# Altium schematic sheet main_MCU-edited.SchDoc
size 1016 x 635 mm; SheetNumber: 1; SheetTotal: 2
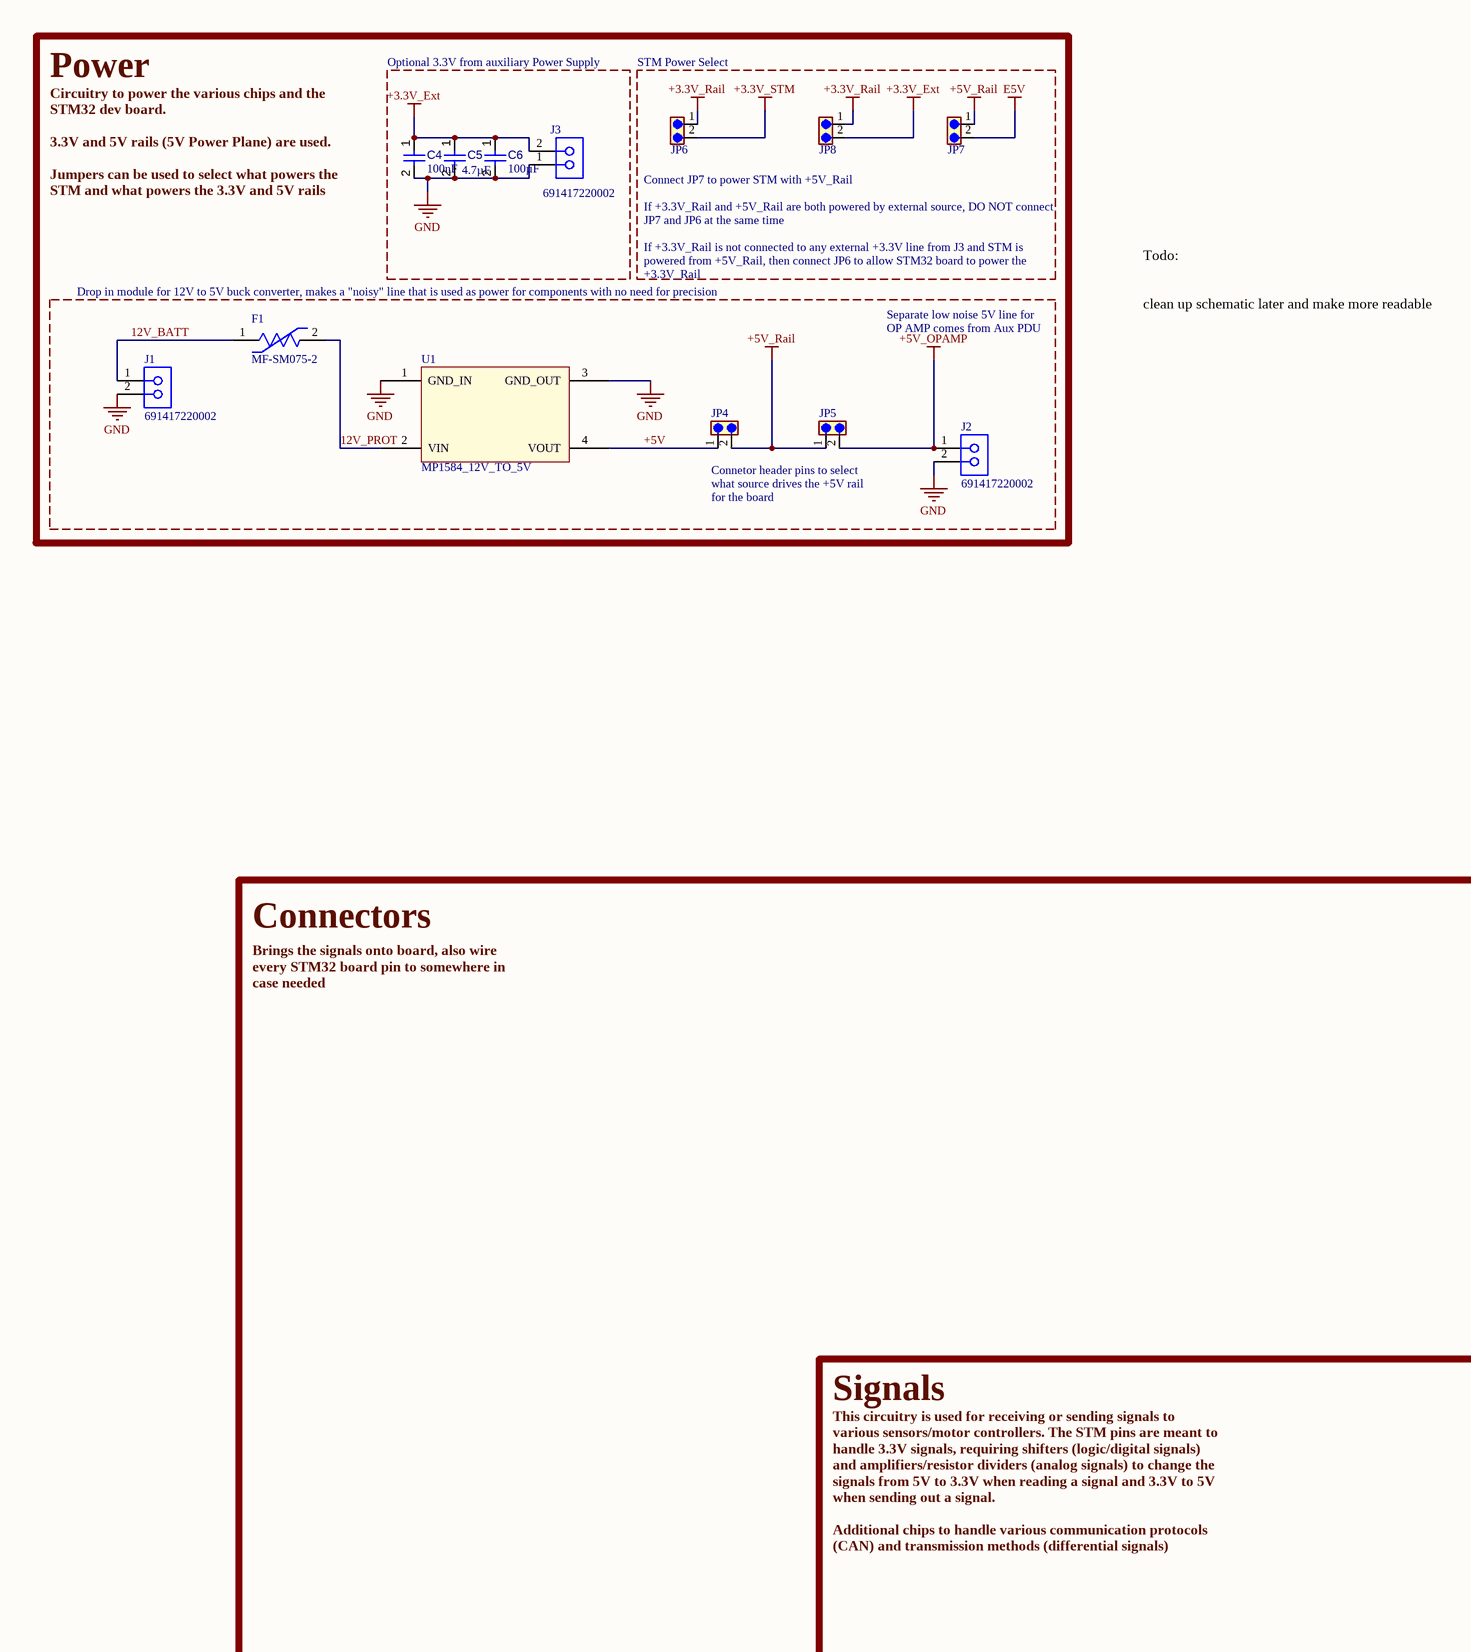
[diagram p0: main_MCU-edited.SchDoc, top left]
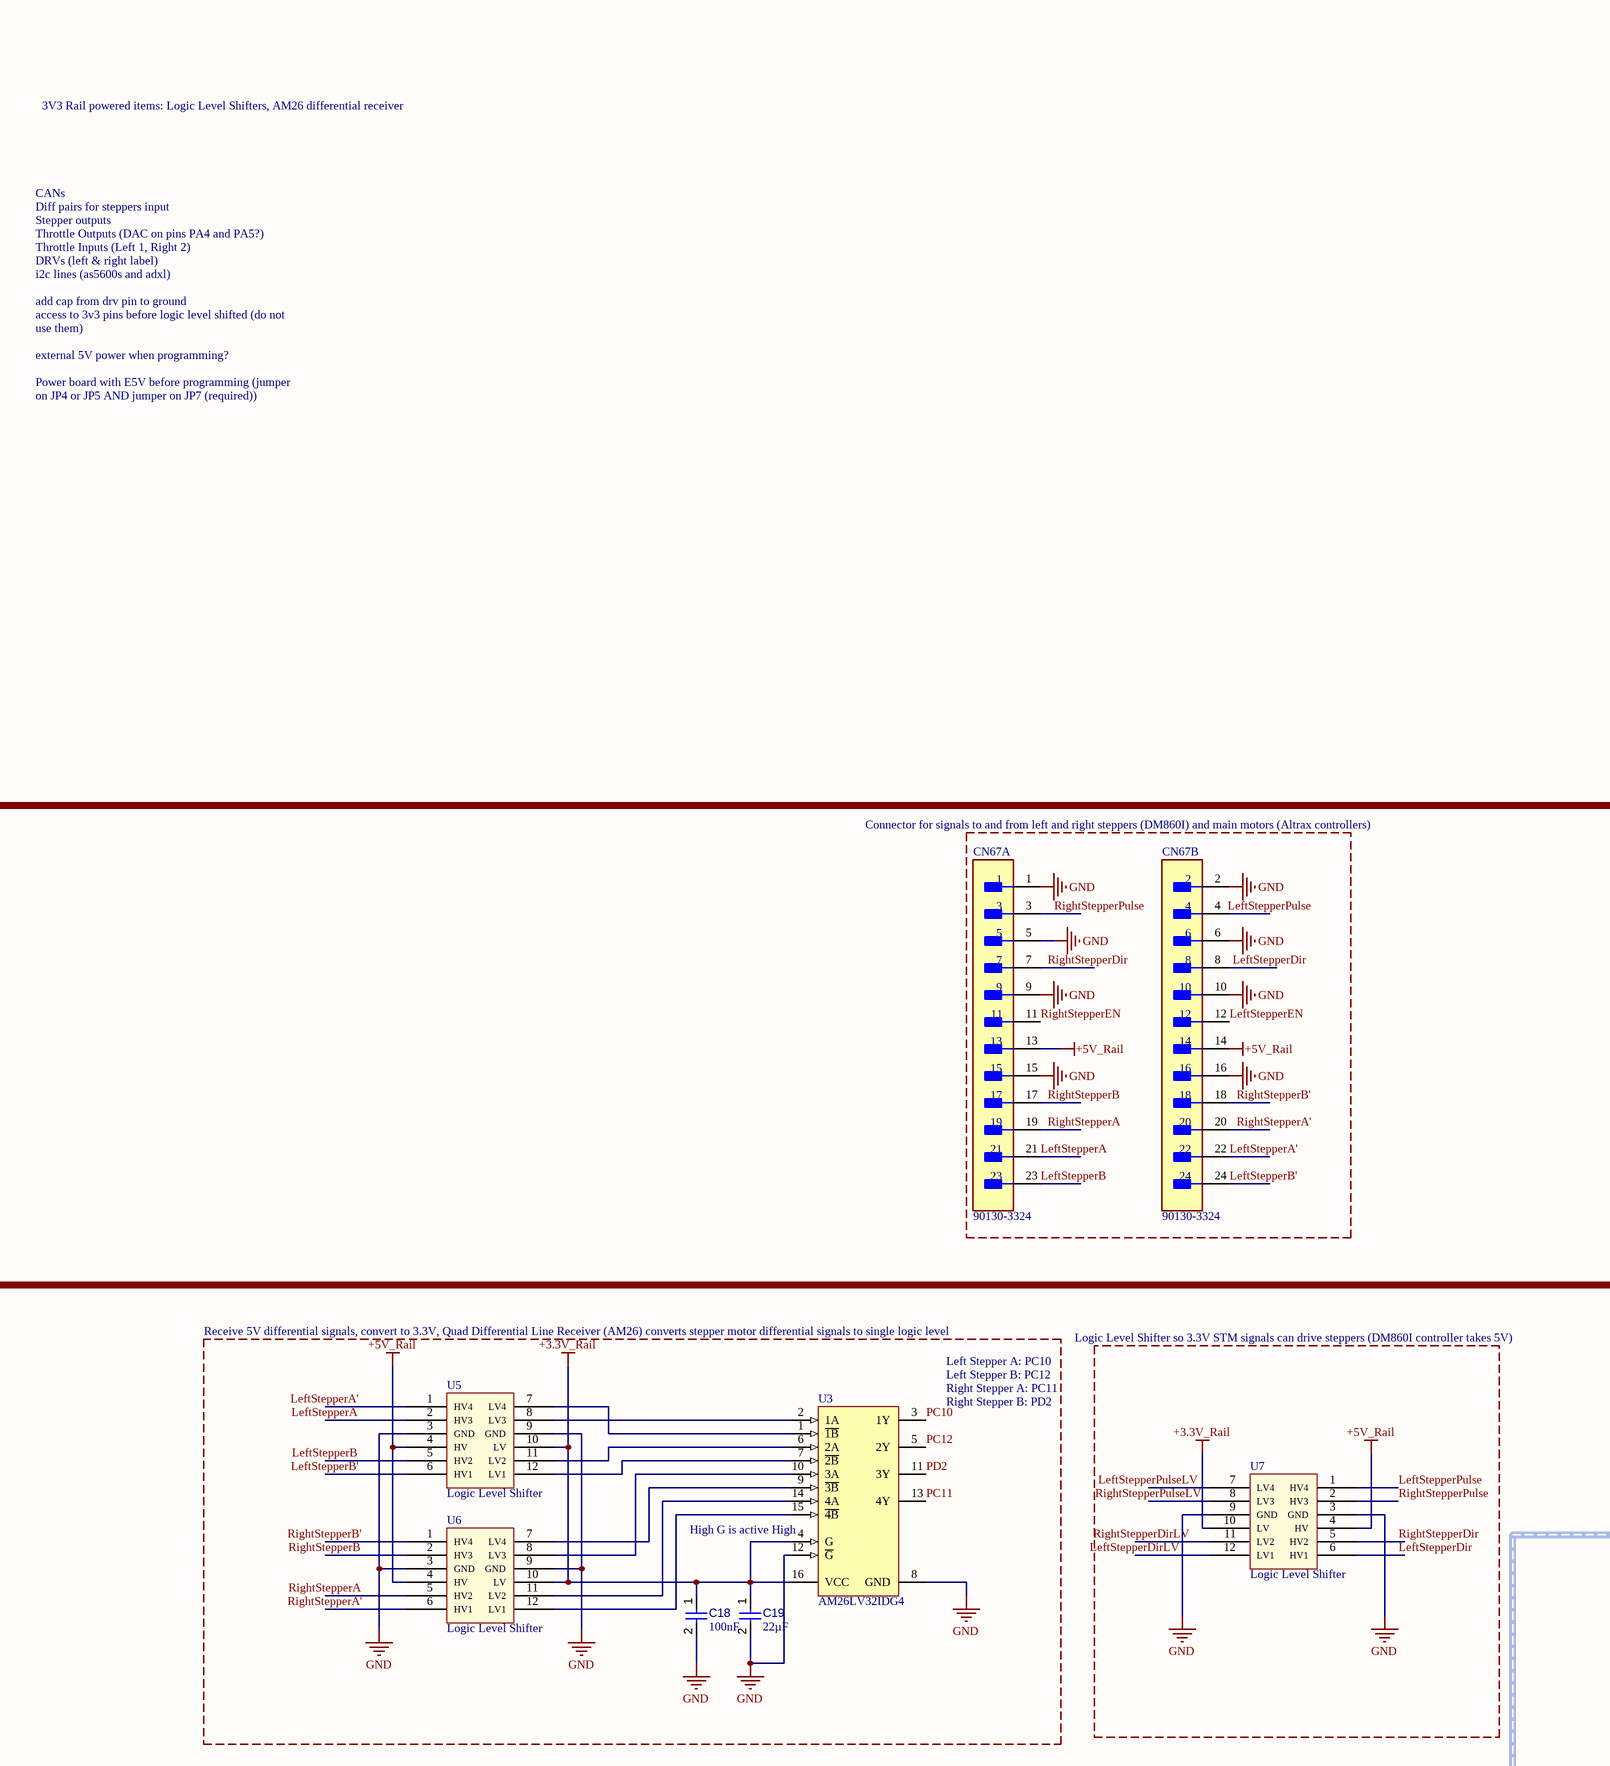
[diagram p1: main_MCU-edited.SchDoc, top middle]
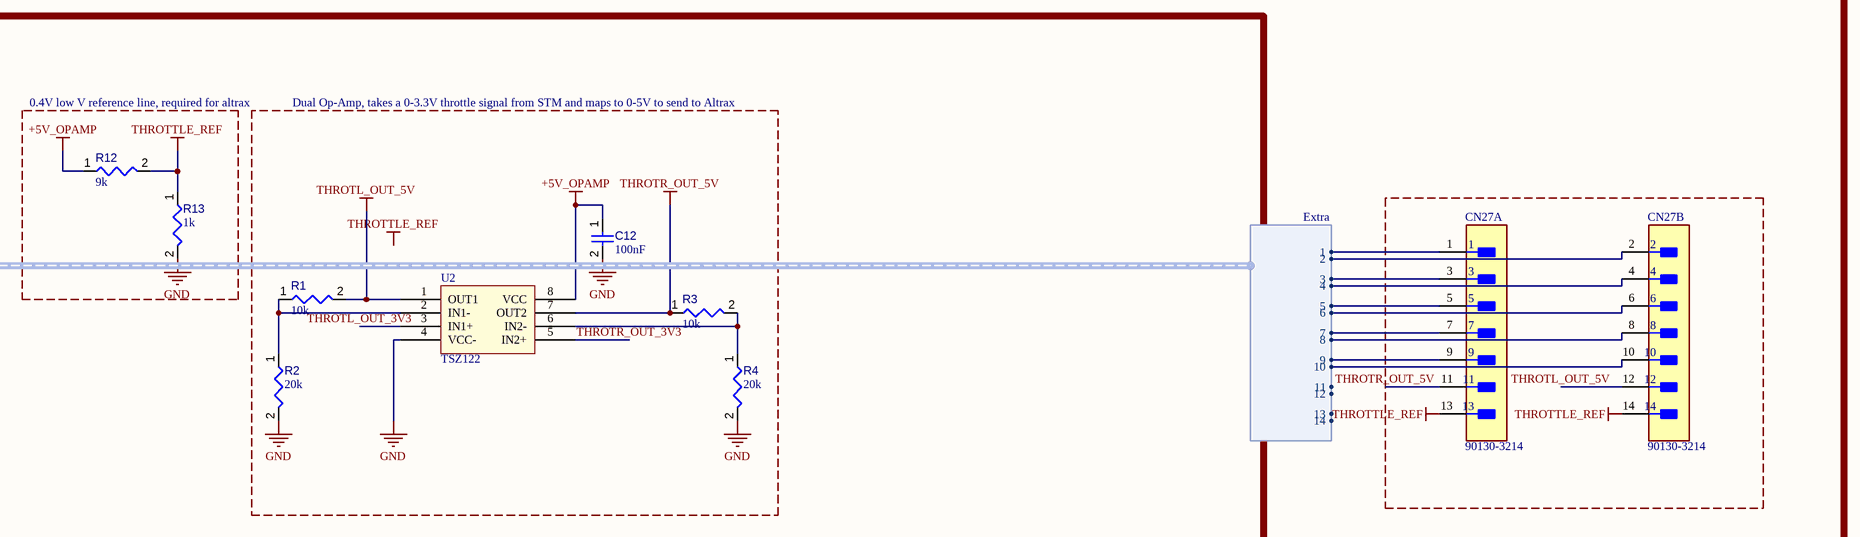
[diagram p2: main_MCU-edited.SchDoc, top right]
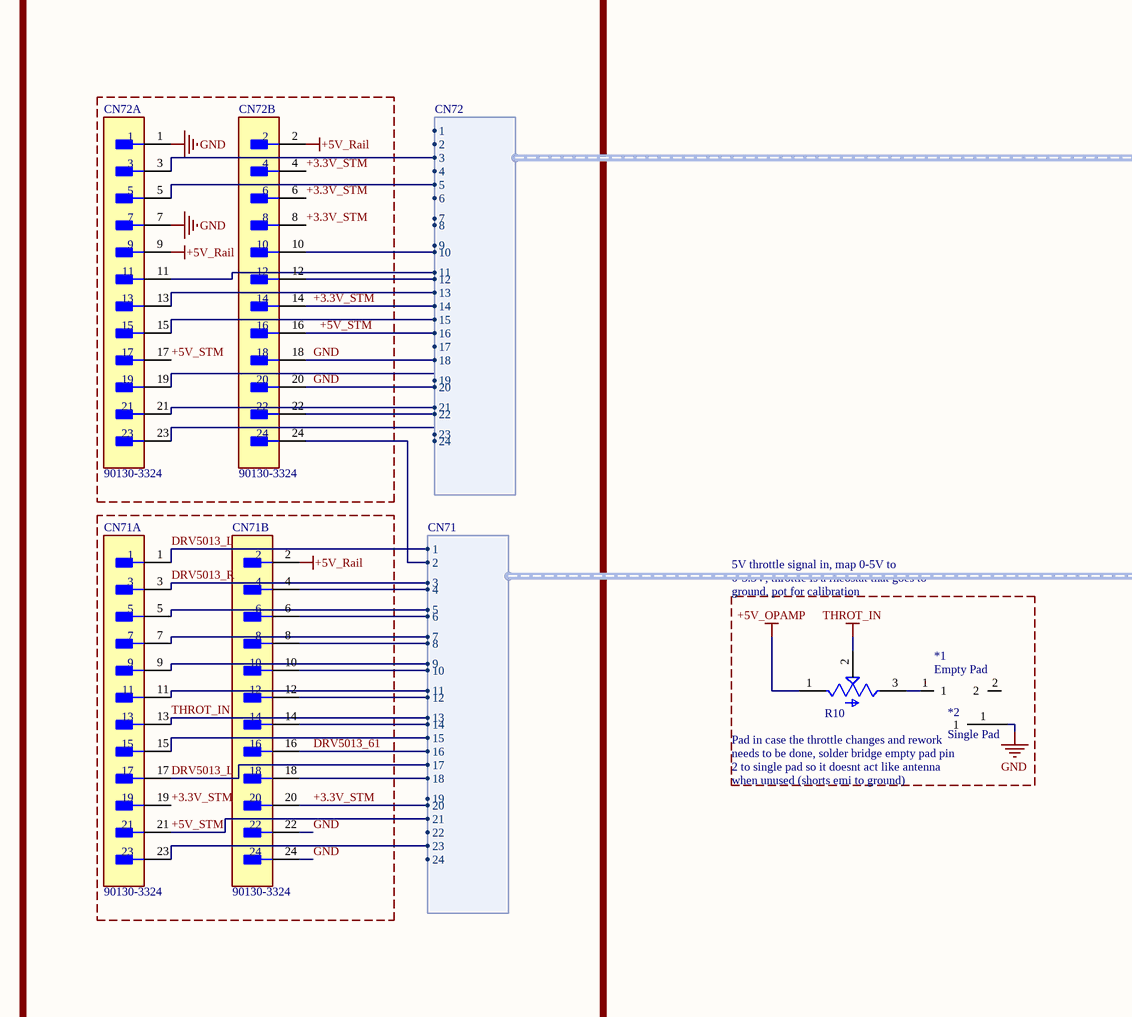
[diagram p3: main_MCU-edited.SchDoc, bottom left]
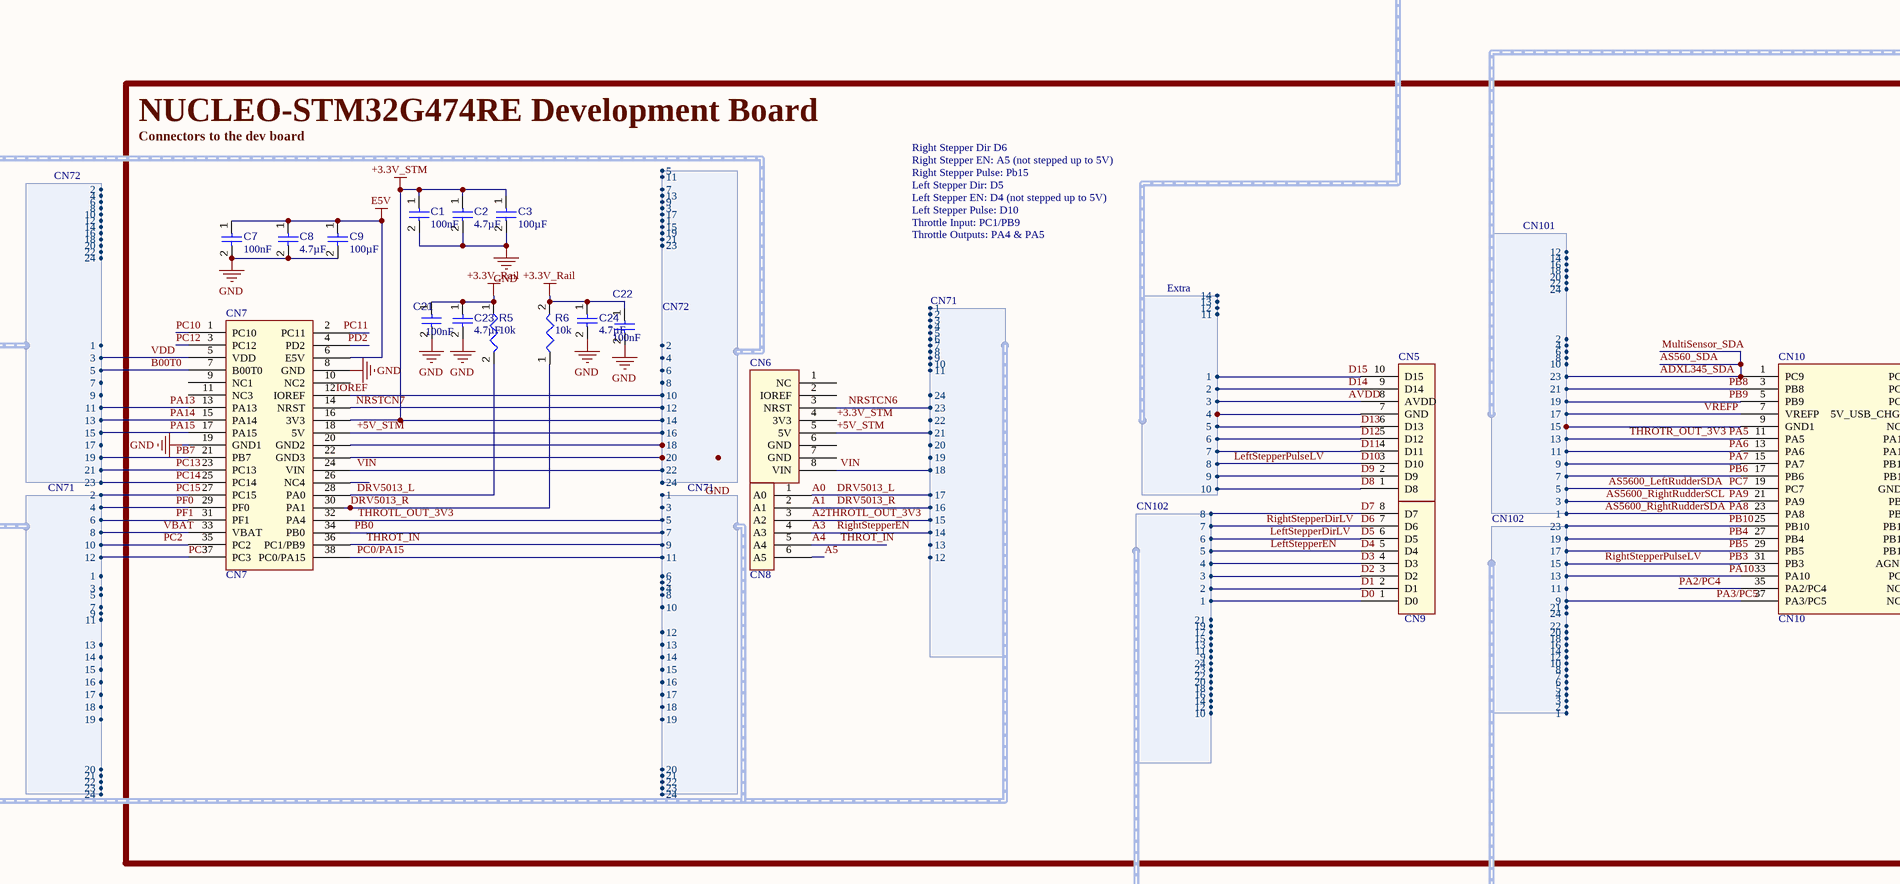
[diagram p4: main_MCU-edited.SchDoc, bottom middle]
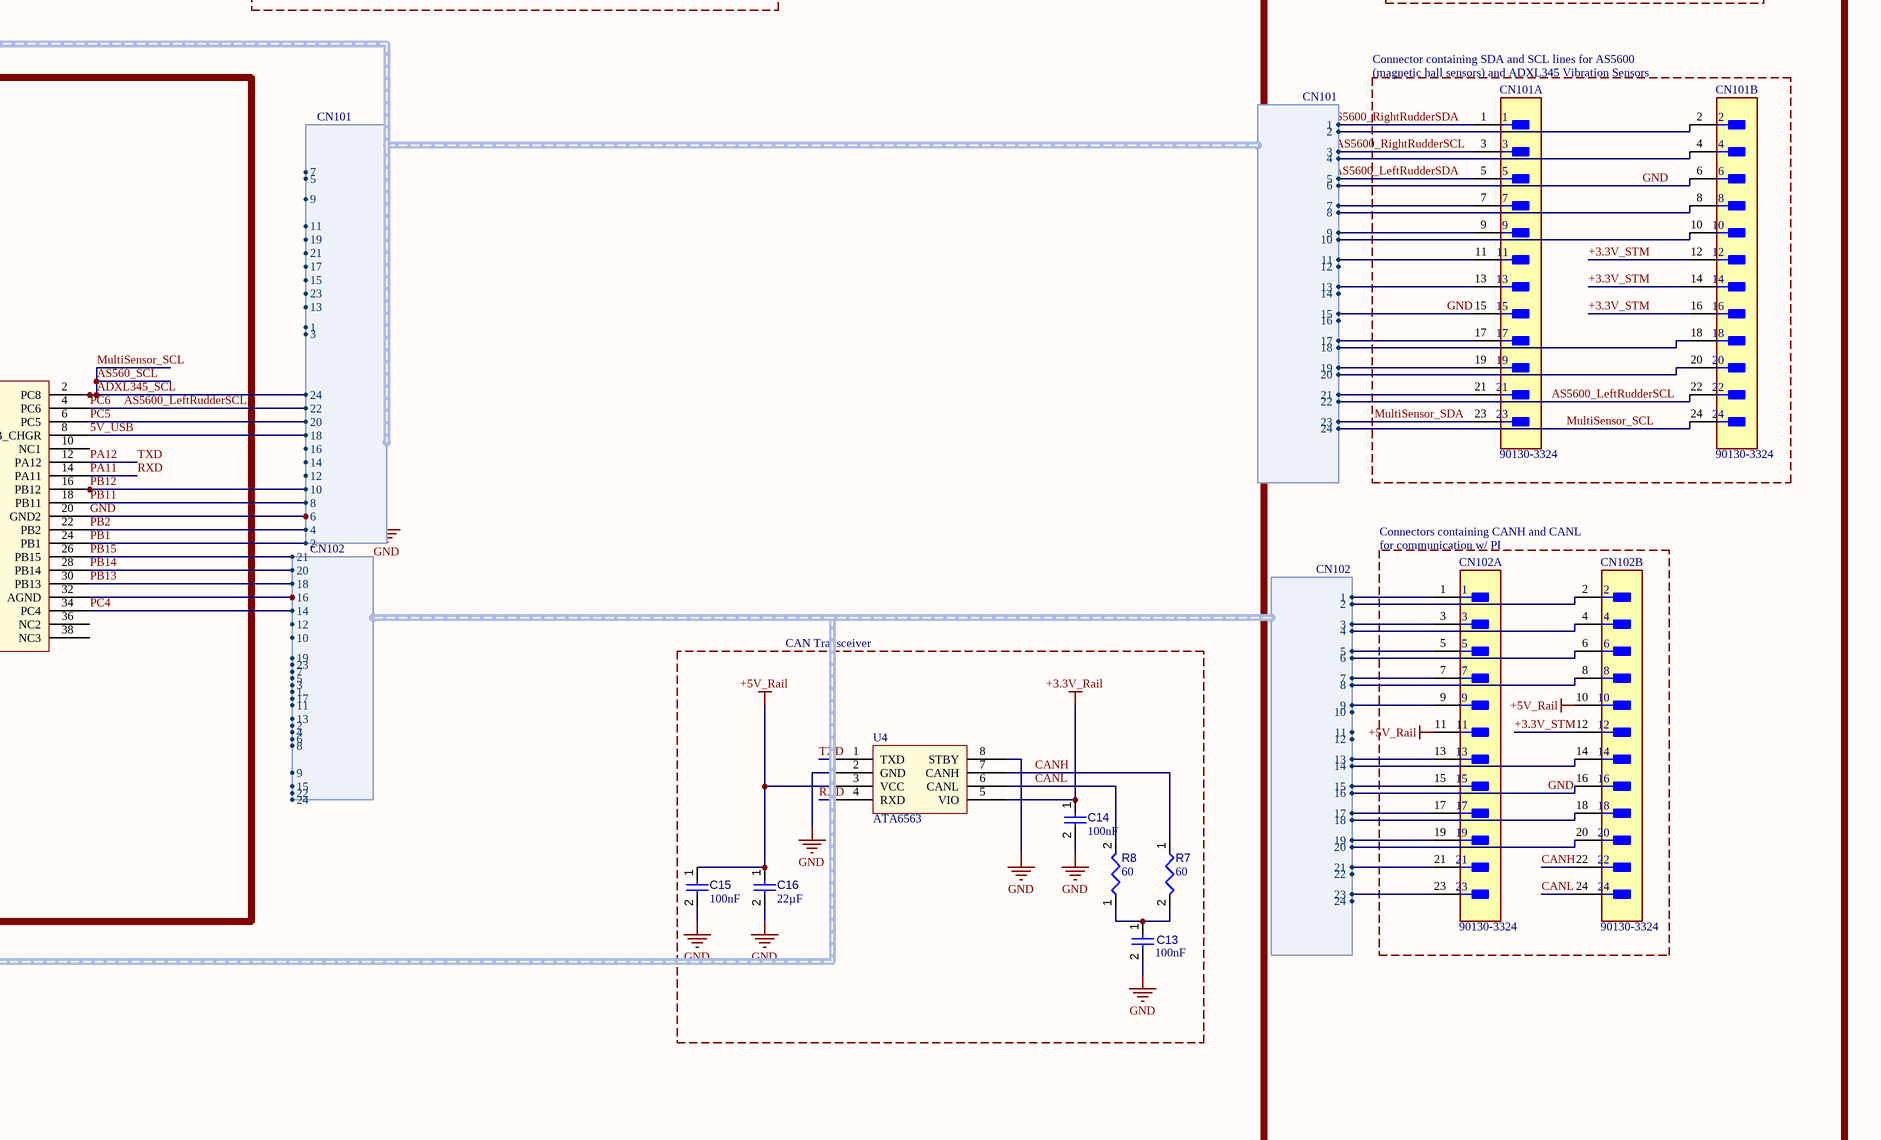
[diagram p5: main_MCU-edited.SchDoc, bottom right]

## Parts
*1  Empty Pad  [PCBComponent_1]
*2  Single Pad  [Single Pad]
C1  value 100nF  [CAPC0805(2012)145_L]  (hidden comment: Capacitor 4.7µF +/-40% 25V 0805)
C2  value 4.7µF  [CAPC0805(2012)145_L]  (hidden comment: Capacitor 4.7µF +/-40% 25V 0805)
C3  value 100µF  [CAPC0805(2012)145_L]  (hidden comment: Capacitor 100µF +/-20% 6.3V 0805)
C4  value 100nF  [CAPC1005X56X25LL10T15]  (hidden comment: Capacitor 0.1 uF +/- 5% 16 V 0402)
C5  value 4.7µF  [CAPC0805(2012)145_L]  (hidden comment: Capacitor 4.7µF +/-40% 25V 0805)
C6  value 100µF  [CAPC0805(2012)145_L]  (hidden comment: Capacitor 100µF +/-20% 6.3V 0805)
C7  value 100nF  [CAPC0805(2012)145_L]  (hidden comment: Capacitor 4.7µF +/-40% 25V 0805)
C8  value 4.7µF  [CAPC0805(2012)145_L]  (hidden comment: Capacitor 4.7µF +/-40% 25V 0805)
C9  value 100µF  [CAPC0805(2012)145_L]  (hidden comment: Capacitor 100µF +/-20% 6.3V 0805)
C12  value 100nF  [CAPC0805(2012)145_L]  (hidden comment: Capacitor 4.7µF +/-40% 25V 0805)
C13  value 100nF  [CAPC0805(2012)145_L]  (hidden comment: Capacitor 4.7µF +/-40% 25V 0805)
C14  value 100nF  [CAPC0805(2012)145_L]  (hidden comment: Capacitor 4.7µF +/-40% 25V 0805)
C15  value 100nF  [CAPC0805(2012)145_L]  (hidden comment: Capacitor 4.7µF +/-40% 25V 0805)
C16  value 22µF  [CAPC0805(2012)145_L]  (hidden comment: Capacitor 22µF +/-40% 16V 0805)
C18  value 100nF  [CAPC0805(2012)145_L]  (hidden comment: Capacitor 4.7µF +/-40% 25V 0805)
C19  value 22µF  [CAPC0805(2012)145_L]  (hidden comment: Capacitor 22µF +/-40% 16V 0805)
C21  value 100nF  [CAPC0805(2012)145_L]  (hidden comment: Capacitor 4.7µF +/-40% 25V 0805)
C22  value 100nF  [CAPC0805(2012)145_L]  (hidden comment: Capacitor 4.7µF +/-40% 25V 0805)
C23  value 4.7µF  [CAPC0805(2012)145_L]  (hidden comment: Capacitor 4.7µF +/-40% 25V 0805)
C24  value 4.7µF  [CAPC0805(2012)145_L]  (hidden comment: Capacitor 4.7µF +/-40% 25V 0805)
CN5  arduino_HDR_1x10  [1x10]  (value not drawn)
CN6  Comment  [1x8_D8]  (value not drawn)
CN7  CN7  [morpho_headers]
CN8  arduino_HDR_1x6_AN  [1x6]  (value not drawn)
CN9  arduino_HDR_1x8_DIG  [1x8]  (value not drawn)
CN10  CN10  [morpho_headers]
CN27  90130-3214  [FP-90130-3214-MFG]  (parts A,B of 2)
CN67  90130-3324  [FP-90130-3324-MFG]  (parts A,B of 2)
CN71  90130-3324  [FP-90130-3324-MFG]  (parts A,B of 2)
CN72  90130-3324  [FP-90130-3324-MFG]  (parts A,B of 2)
CN101  90130-3324  [FP-90130-3324-MFG]  (parts A,B of 2)
CN102  90130-3324  [FP-90130-3324-MFG]  (parts A,B of 2)
F1  MF-SM075-2  [FP-MF-SM075-MFG]
J1  691417220002  [691417220002]
J2  691417220002  [691417220002]
J3  691417220002  [691417220002]
JP4  6130XX11121_61300211121  [61300211121]  (value not drawn)
JP5  6130XX11121_61300211121  [61300211121]  (value not drawn)
JP6  6130XX11121_61300211121  [61300211121]  (value not drawn)
JP7  6130XX11121_61300211121  [61300211121]  (value not drawn)
JP8  6130XX11121_61300211121  [61300211121]  (value not drawn)
R1  value 10k  [RESC2013X50X35ML15T15]  (hidden comment: Resistor 10k +/-1% 0805 125 mW)
R2  value 20k  [RESC2013X50X35ML15T15]  (hidden comment: Resistor 10k +/-1% 0805 125 mW)
R3  value 10k  [RESC2013X50X35ML15T15]  (hidden comment: Resistor 10k +/-1% 0805 125 mW)
R4  value 20k  [RESC2013X50X35ML15T15]  (hidden comment: Resistor 10k +/-1% 0805 125 mW)
R5  value 10k  [RESC2013X50X35ML15T15]  (hidden comment: Resistor 10k +/-1% 0805 125 mW)
R6  value 10k  [RESC2013X50X35ML15T15]  (hidden comment: Resistor 10k +/-1% 0805 125 mW)
R7  value 60  [RESC1005X40X25ML10T10]  (hidden comment: Resistor 33R +/-1% 0402 63 mW)
R8  value 60  [RESC1005X40X25ML10T10]  (hidden comment: Resistor 33R +/-1% 0402 63 mW)
R10  TC33X-2-103E  [TRIM_TC33X-2-103E]  (value not drawn)
R12  value 9k  [RESC2013X50X35ML15T15]  (hidden comment: Resistor 10k +/-1% 0805 125 mW)
R13  value 1k  [RESC2013X50X35ML15T15]  (hidden comment: Resistor 10k +/-1% 0805 125 mW)
U1  MP1584_12V_TO_5V  [BUCK_MODULE]
U2  TSZ122  [SOIC8]
U3  AM26LV32IDG4  [D16_N]
U4  ATA6563  [SOP8]
U5  Logic Level Shifter  [LogicLevelShifter]
U6  Logic Level Shifter  [LogicLevelShifter]
U7  Logic Level Shifter  [LogicLevelShifter]

## Blocks framed on the sheet
Optional 3.3V from auxiliary Power Supply: C4-C6 J3
STM Power Select: JP6-JP8
0.4V low V reference line, required for altrax: R12 R13
CAN Transceiver: C13-C16 R7 R8 U4

## Harnesses
CN72: 1, 2, 3, 4, 5, 6, 7, 8, 9, 10, 11, 12, 13, 14, 15, 16, 17, 18, 19, 20, 21, 22, 23, 24
CN71: 1, 2, 3, 4, 5, 6, 7, 8, 9, 10, 11, 12, 13, 14, 15, 16, 17, 18, 19, 20, 21, 22, 23, 24
CN102: 1, 2, 3, 4, 5, 6, 7, 8, 9, 10, 11, 12, 13, 14, 15, 16, 17, 18, 19, 20, 21, 22, 23, 24
CN101: 1, 2, 3, 4, 5, 6, 7, 8, 9, 10, 11, 12, 13, 14, 15, 16, 17, 18, 19, 20, 21, 22, 23, 24
Extra: 1, 2, 5, 6, 7, 8, 9, 10, 11, 12, 13, 14, 3, 4

## Nets
+3.3V_Ext: C4.1 C5.1 C6.1 J3.2 JP8.2
+3.3V_Rail: C14.1 C18.1 C19.1 C21.1 C22.1 C23.1 C24.1 JP6.1 JP8.1 R5.1 R6.2 U3.4(G) U3.16(VCC) U4.5(VIO) U5.10(LV) U6.10(LV) U7.10(LV)
+3.3V_STM: C1.1 C2.1 C3.1 CN6.4(3V3) CN7.16(3V3) CN71.19 CN71.20 CN72.4 CN72.6 CN72.8 CN72.14 CN101.12 CN101.14 CN101.16 CN102.12 JP6.2 ; harness CN72.14, harness CN71.20
+5V_OPAMP: C12.1 J2.1 JP5.2 R10.1(CCW) R12.1 U2.8(VCC)
+5V_Rail: C15.1 C16.1 CN67.13 CN67.14 CN71.2 CN72.2 CN72.9 CN102.10 CN102.11 JP4.2 JP5.1 JP7.1 U4.3(VCC) U5.4(HV) U6.4(HV) U7.4(HV)
A4: CN7.36(PC1/PB9) CN8.5(A4) CN71.9 CN71.13 R10.2(W) ; harness CN71.9, harness CN71.13  [also labelled THROT_IN]
E5V: C7.1 C8.1 C9.1 CN7.6(E5V) JP7.2
GND: *2.1 C1.2 C2.2 C3.2 C4.2 C5.2 C6.2 C7.2 C8.2 C9.2 C12.2 C13.2 C14.2 C15.2 C16.2 C18.2 C19.2 C21.2 C22.2 C23.2 C24.2 CN5.7(GND) CN7.8(GND) CN7.19(GND1) CN7.20(GND2) CN7.22(GND3) CN10.9(GND1) CN10.20(GND2) CN10.32(AGND) CN27.4 CN67.1 CN67.2 CN67.5 CN67.6 CN67.9 CN67.10 CN67.15 CN67.16 CN71.22 CN71.24 CN72.1 CN72.7 CN72.18 CN72.20 CN101.6 CN101.15 CN102.16 J1.2 J2.2 J3.1 R2.2 R4.2 R13.2 U1.1(GND_IN) U1.3(GND_OUT) U2.4(VCC-) U3.8(GND) U3.12(~{G}) U4.2(GND) U4.8(STBY) U5.3(GND) U5.9(GND) U6.3(GND) U6.9(GND) U7.3(GND) U7.9(GND) ; harness CN72.18, harness CN72.20, harness CN102.16, harness CN101.6, harness CN101.15, harness Extra.4
THROTL_OUT_5V: CN27.12 R1.2 U2.1(OUT1)
THROTR_OUT_5V: CN27.11 R3.1 U2.7(OUT2)
THROTTLE_REF: CN27.13 CN27.14 R12.2 R13.1
5V_USB: CN10.8(5V_USB_CHGR) CN101.18 ; harness CN101.18
12V_BATT: F1.1 J1.1
12V_PROT: F1.2 U1.2(VIN)
+5V: JP4.1 U1.4(VOUT)
+5V_STM: CN6.5(5V) CN7.18(5V) CN71.21 CN72.16 CN72.17 ; harness CN72.16, harness CN71.21
A0: CN7.28(PA0) CN8.1(A0) CN71.1 CN71.17 R5.2 ; harness CN71.1, harness CN71.17  [also labelled DRV5013_L]
A1: CN7.30(PA1) CN8.2(A1) CN71.3 CN71.16 R6.1 ; harness CN71.3, harness CN71.16  [also labelled DRV5013_61, DRV5013_R]
A2: CN7.32(PA4) CN8.3(A2) CN71.5 CN71.15 U2.3(IN1+) ; harness CN71.5, harness CN71.15  [also labelled THROTL_OUT_3V3]
A3: CN8.4(A3) CN67.11 CN71.14 ; harness CN71.14  [also labelled RightStepperEN]
A5: CN8.6(A5)
ADXL345_SCL: CN10.2(PC8) CN101.24 ; harness CN101.24  [also labelled AS560_SCL, MultiSensor_SCL]
ADXL345_SDA: CN10.1(PC9) CN101.23 ; harness CN101.23  [also labelled AS560_SDA, MultiSensor_SDA]
AS5600_LeftRudderSCL: CN10.4(PC6) CN101.22 ; harness CN101.22  [also labelled PC6]
AS5600_LeftRudderSDA: CN10.19(PC7) CN101.5 ; harness CN101.5  [also labelled PC7]
AS5600_RightRudderSCL: CN10.21(PA9) CN101.3 ; harness CN101.3  [also labelled PA9]
AS5600_RightRudderSDA: CN10.23(PA8) CN101.1 ; harness CN101.1  [also labelled PA8]
AVDD: CN5.8(AVDD) CN27.3 ; harness Extra.3
B00T0: CN7.7(B00T0) CN72.5 ; harness CN72.5
CANH: CN102.22 R7.1 U4.7(CANH)
CANL: CN102.24 R8.2 U4.6(CANL)
D0: CN9.1(D0) CN102.1 ; harness CN102.1
D1: CN9.2(D1) CN102.2 ; harness CN102.2
D2: CN9.3(D2) CN102.3 ; harness CN102.3
D3: CN9.4(D3) CN102.4 ; harness CN102.4
D4: CN9.5(D4) CN67.12 CN102.5 ; harness CN102.5  [also labelled LeftStepperEN]
D5: CN9.6(D5) CN102.6 U7.12(LV1) ; harness CN102.6  [also labelled LeftStepperDirLV]
D6: CN9.7(D6) CN102.7 U7.11(LV2) ; harness CN102.7  [also labelled RightStepperDirLV]
D7: CN9.8(D7) CN102.8 ; harness CN102.8
D8: CN5.1(D8) CN27.10 ; harness Extra.10
D9: CN5.2(D9) CN27.9 ; harness Extra.9
D10: CN5.3(D10) CN27.8 U7.7(LV4) ; harness Extra.8  [also labelled LeftStepperPulseLV]
D11: CN5.4(D11) CN27.7 ; harness Extra.7
D12: CN5.5(D12) CN27.6 ; harness Extra.6
D13: CN5.6(D13) CN27.5 ; harness Extra.5
D14: CN5.9(D14) CN27.2 ; harness Extra.2
D15: CN5.10(D15) CN27.1 ; harness Extra.1
IOREF: CN7.12(IOREF) CN72.10 ; harness CN72.10
LeftStepperA: CN67.21 U5.2(HV3)
LeftStepperA': CN67.22 U5.1(HV4)
LeftStepperB: CN67.23 U5.5(HV2)
LeftStepperB': CN67.24 U5.6(HV1)
LeftStepperDir: CN67.8 U7.6(HV1)
LeftStepperPulse: CN67.4 U7.1(HV4)
NRSTCN6: CN6.3(NRST) CN71.23 ; harness CN71.23
NRSTCN7: CN7.14(NRST) CN72.12 ; harness CN72.12
PA2/PC4: CN10.35(PA2/PC4)
PA3/PC5: CN10.37(PA3/PC5) CN102.9 ; harness CN102.9
PA5: CN10.11(PA5) CN101.13 U2.5(IN2+) ; harness CN101.13  [also labelled THROTR_OUT_3V3]
PA6: CN10.13(PA6) CN101.11 ; harness CN101.11
PA7: CN10.15(PA7) CN101.9 ; harness CN101.9
PA10: CN10.33(PA10) CN102.13 ; harness CN102.13
PA11: CN10.14(PA11) U4.4(RXD)  [also labelled RXD]
PA12: CN10.12(PA12) U4.1(TXD)  [also labelled TXD]
PA13: CN7.13(PA13) CN72.11 ; harness CN72.11
PA14: CN7.15(PA14) CN72.13 ; harness CN72.13
PA15: CN7.17(PA15) CN72.15 ; harness CN72.15
PB0: CN7.34(PB0) CN71.7 ; harness CN71.7
PB1: CN10.24(PB1) CN101.2 ; harness CN101.2
PB2: CN10.22(PB2) CN101.4 ; harness CN101.4
PB3: CN10.31(PB3) CN102.15 U7.8(LV3) ; harness CN102.15  [also labelled RightStepperPulseLV]
PB4: CN10.27(PB4) CN102.19 ; harness CN102.19
PB5: CN10.29(PB5) CN102.17 ; harness CN102.17
PB6: CN10.17(PB6) CN101.7 ; harness CN101.7
PB7: CN7.21(PB7) CN72.19 ; harness CN72.19
PB8: CN10.3(PB8) CN101.21 ; harness CN101.21
PB9: CN10.5(PB9) CN101.19 ; harness CN101.19
PB10: CN10.25(PB10) CN102.23 ; harness CN102.23
PB11: CN10.18(PB11) CN101.8 ; harness CN101.8
PB12: CN10.16(PB12) CN101.10 ; harness CN101.10
PB13: CN10.30(PB13) CN102.18 ; harness CN102.18
PB14: CN10.28(PB14) CN102.20 ; harness CN102.20
PB15: CN10.26(PB15) CN102.21 ; harness CN102.21
PC0/PA15: CN7.38(PC0/PA15) CN71.11 ; harness CN71.11
PC2: CN7.35(PC2) CN71.10 ; harness CN71.10
PC3: CN7.37(PC3) CN71.12 ; harness CN71.12
PC4: CN10.34(PC4) CN102.14 ; harness CN102.14
PC5: CN10.6(PC5) CN101.20 ; harness CN101.20
PC10: CN7.1(PC10) U3.3(1Y)
PC11: CN7.2(PC11) U3.13(4Y)
PC12: CN7.3(PC12) U3.5(2Y)
PC13: CN7.23(PC13) CN72.21 ; harness CN72.21
PC14: CN7.25(PC14) CN72.23 ; harness CN72.23
PC15: CN7.27(PC15) CN72.24 ; harness CN71.2
PD2: CN7.4(PD2) U3.11(3Y)
PF0: CN7.29(PF0) CN71.4 ; harness CN71.4
PF1: CN7.31(PF1) CN71.6 ; harness CN71.6
RightStepperA: CN67.19 U6.5(HV2)
RightStepperA': CN67.20 U6.6(HV1)
RightStepperB: CN67.17 U6.2(HV3)
RightStepperB': CN67.18 U6.1(HV4)
RightStepperDir: CN67.7 U7.5(HV2)
RightStepperPulse: CN67.3 U7.2(HV3)
VBAT: CN7.33(VBAT) CN71.8 ; harness CN71.8
VDD: CN7.5(VDD) CN72.3 ; harness CN72.3
VIN: CN6.8(VIN) CN7.24(VIN) CN71.18 CN72.22 ; harness CN72.22, harness CN71.18
VREFP: CN10.7(VREFP) CN101.17 ; harness CN101.17
Net*1_1: *1.1 R10.3(CW)
NetC13_1: C13.1 R7.2 R8.1
NetR1_1: R1.1 R2.1 U2.2(IN1-)
NetR3_2: R3.2 R4.1 U2.6(IN2-)
NetU3_1: U3.1(~{1B}) U5.7(LV4)
NetU3_2: U3.2(1A) U5.8(LV3)
NetU3_6: U3.6(2A) U5.11(LV2)
NetU3_7: U3.7(~{2B}) U5.12(LV1)
NetU3_9: U3.9(~{3B}) U6.7(LV4)
NetU3_10: U3.10(3A) U6.8(LV3)
NetU3_14: U3.14(4A) U6.11(LV2)
NetU3_15: U3.15(~{4B}) U6.12(LV1)

Not connected (* = marked no-connect by the designer): *1 2; CN6 1(NC) 2(IOREF) 6(GND) 7(GND); CN7 9(NC1) 10(NC2) 11(NC3) 26(NC4); CN10 10(NC1) 36(NC2) 38(NC3)

## Notes on the sheet
- Power
- Circuitry to power the various chips and the STM32 dev board.
  3.3V and 5V rails (5V Power Plane) are used.
  Jumpers can be used to select what powers the STM and what powers the 3.3V and 5V rails
- (near F1) Drop in module for 12V to 5V buck converter, makes a "noisy" line that is used as power for components with no need for precision
- Connect JP7 to power STM with +5V_Rail
  If +3.3V_Rail and +5V_Rail are both powered by external source, DO NOT connect JP7 and JP6 at the same time
  If +3.3V_Rail is not connected to any external +3.3V line from J3 and STM is powered from +5V_Rail, then connect JP6 to allow STM32 board to power the +3.3V_Rail
- 3V3 Rail powered items: Logic Level Shifters, AM26 differential receiver
- Separate low noise 5V line for OP AMP comes from Aux PDU
- Connetor header pins to select what source drives the +5V rail for the board
- Todo:
  clean up schematic later and make more readable
- CANs
  Diff pairs for steppers input
  Stepper outputs
  Throttle Outputs (DAC on pins PA4 and PA5?)
  Throttle Inputs (Left 1, Right 2)
  DRVs (left & right label)
  i2c lines (as5600s and adxl)
  add cap from drv pin to ground
  access to 3v3 pins before logic level shifted (do not use them)
  external 5V power when programming?
  Power board with E5V before programming (jumper on JP4 or JP5 AND jumper on JP7 (required))
- Connectors
- Connector for signals to and from left and right steppers (DM860I) and main motors (Altrax controllers)
- Brings the signals onto board, also wire every STM32 board pin to somewhere in case needed
- Signals
- Receive 5V differential signals, convert to 3.3V, Quad Differential Line Receiver (AM26) converts stepper motor differential signals to single logic level
- Logic Level Shifter so 3.3V STM signals can drive steppers (DM860I controller takes 5V)
- (near U3) Left Stepper A: PC10
  Left Stepper B: PC12
  Right Stepper A: PC11
  Right Stepper B: PD2
- Dual Op-Amp, takes a 0-3.3V throttle signal from STM and maps to 0-5V to send to Altrax
- This circuitry is used for receiving or sending signals to various sensors/motor controllers. The STM pins are meant to handle 3.3V signals, requiring shifters (logic/digital signals) and amplifiers/resistor dividers (analog signals) to change the signals from 5V to 3.3V when reading a signal and 3.3V to 5V when sending out a signal.
  Additional chips to handle various communication protocols (CAN) and transmission methods (differential signals)
- (near U3) High G is active High
- NUCLEO-STM32G474RE Development Board
- (near CN101) Connector containing SDA and SCL lines for AS5600 (magnetic hall sensors) and ADXL345 Vibration Sensors
- Connectors to the dev board
- Right Stepper Dir D6
  Right Stepper EN: A5 (not stepped up to 5V)
  Right Stepper Pulse: Pb15
  Left Stepper Dir: D5
  Left Stepper EN: D4 (not stepped up to 5V)
  Left Stepper Pulse: D10
  Throttle Input: PC1/PB9
  Throttle Outputs: PA4 & PA5
- 5V throttle signal in, map 0-5V to 0-3.3V, throttle is a rheostat that goes to ground, pot for calibration
- (near CN102) Connectors containing CANH and CANL for communication w/ PI
- (near *2) Pad in case the throttle changes and rework needs to be done, solder bridge empty pad pin 2 to single pad so it doesnt act like antenna when unused (shorts emi to ground)
- Labels drawn without touching a wire or pin: THROTTLE_REF

## Library data of the parts
*1 = Component_1
C1 C2 C5 C7 C8 C12-C15 C18 C21-C24 = CMP-001-00080-4: Chip Capacitor, 4.7µF +/-40%, 25V, 0805, Thickness 1.45 mm; Tolerance: 20%; Voltage Rating: 25V; Min Operating Temperature: -55°C; Max Operating Temperature: 85°C; Pins: 2; Mounting Technology: SMT; Case/Package: 0805
C3 C6 C9 = CMP-001-00054-4: Chip Capacitor, 100µF +/-20%, 6.3V, 0805, Thickness 1.45 mm; Tolerance: 10%; Min Operating Temperature: -55°C; Max Operating Temperature: 85°C; Pins: 2; Mounting Technology: SMT; Case/Package: 0805; Voltage Rating: 6.3V
C4 = CMP-001-00001-6: Chip Capacitor, 0.1 uF, +/- 5%, 16 V, 0402 (1005 Metric); Capacitor Type: Ceramic; Voltage Rating: 16V; Max Operating Temperature: 125°C; Min Operating Temperature: -55°C; Case/Package: 0402; Mounting Technology: SM; Pins: 2; Tolerance: 5%; RoHS Compliant: True
C16 C19 = CMP-001-00081-4: Chip Capacitor, 22µF +/-40%, 16V, 0805, Thickness 1.45 mm; Tolerance: 5%; Voltage Rating: 16V; Mounting Technology: SMT; Pins: 2; Max Operating Temperature: 85°C; Case/Package: 0805; Min Operating Temperature: -55°C
CN6 = arduino_HDR_1x8_PWR
CN27 = CMP-00257-00655617-1: 90130-3214 Conn Shrouded Header (4 Sides) HDR 14 POS 2.54mm Solder RA Thru-Hole C-Grid III™ Frame; NexarPartId: 655617; Manufacturer Lifecycle Status: ACTIVE; Working Voltage: 350V; Number of Contacts: 14; Gender: Male; Contact Resistance: 20mΩ; Max Voltage Rating (DC): 350.35kV; Plating: Tin; Glow Wire Compliant: Non-compliant; Current Rating: 3A; Insulation Resistance: 5GΩ; Connector Type: Male Pin; Min Operating Temperature: -55°C; Housing Color: Black; Number of Circuits: 14; Contact Plating: Gold; Material: Glass, Polyester; Row Spacing: 2.54mm; Contact Material: Brass, Copper; Orientation: Right Angle; Number of Pins: 14; Country of Origin: SK; Number of Rows: 2; Lead Free: Lead Free; Max Operating Temperature: 125°C; Schedule B: 8536694040; Voltage Rating (DC): 350V; Lifecycle Status: Production; Height: 10.05mm; RoHS: Compliant; Radiation Hardening: No; Housing Material: Polyester; Lead Pitch: 2.54mm; Termination: Solder; Contact Mating Length: 6.7564mm; Color: Black; Mount: Through Hole; Number of Poles: 14; REACH SVHC: Unknown; Number of Positions: 14; Voltage Rating: 350V; Voltage Rating (AC): 350V; Pitch: 2.54mm
CN67 CN71 CN72 CN101 CN102 = CMP-00257-07666362-1: 90130-3324 Conn Shrouded Header HDR 24 POS 2.54mm Solder RA Thru-Hole C-Grid III™ Tray; Manufacturer Lifecycle Status: ACTIVE; Voltage Rating: 350V; Number of Circuits: 20; Number of Contacts: 24; Current Rating: 3A; Plating: Tin; Glow Wire Compliant: Non-compliant; RoHS: Compliant; Lifecycle Status: Production; Number of Rows: 2; Contact Material: Brass; Contact Plating: Gold; Number of Positions: 24; Housing Material: Polyester; NexarPartId: 7666362; Country of Origin: SK; Pitch: 2.54mm; Orientation: Right Angle; Termination: Through Hole
F1 = CMP-07400-000034-1: PTC RESET FUSE 30V 750MA 2SMD; Manufacturer: Bourns Inc.; Trip Time: 0.3s; Value: 0.23-1Ω; Trip Current: 1.5A; Current Rating: 80A; Hold Current: 0.75A; Automotive Grade: Grade 3; Manufacturer Part Number: MF-SM075-2; ComponentLink2URL: https://www.bourns.com/docs/Product-Datasheets/mfsm.pdf; Mouser Description: Fuse; Resettable; 0.75A; Dims 0.314x0.214x0.129"; SMT; 30VDC; DCR 0.23 Ohms; PCB; Lead Free: Yes; Device Class L1: Circuit Protection; Digikey Description: PTC RESET FUSE 30V 750MA 2SMD; Octopart: https://octopart.com/mf-sm075-2-bourns-115843; Category: Fuse; Device Class L2: PTC Resettable Fuses; Ambient Temperature Range Low: -40°C; Device Class L3: unset; Voltage Rating: 30V; Height: 3.18mm; Ambient Temperature Range High: +85°C; Resistance: 0.23-1Ω; Package: MF-SM075; ComponentLink2Description: Datasheet; Temperature Range High: +85°C; Automotive: Yes; Temperature Range Low: -40°C; Temperature: -40°C to +85°C; RoHS: TRUE
J1-J3 = 691417220002: WR-TBL Series 4172 45° Cable Entry, THT, pitch 7mm, 02p; Manufacturer: Wurth Elektronik; Modularity: No; Rated Current: 4A; System: Spring Clamp; Working Voltage: 300V; Manufacturer Part Number: 691417220002; Category: Terminal Block; Match Code: WR-TBL; ComponentLink1Description: Website Link; ComponentLink1URL: https://www.we-online.com/redexpert/article/691417220002?ad; ComponentLink2Description: Datasheet Link; ComponentLink2URL: https://www.we-online.com/redexpert/spec/691417220002?ad; Mount: Through Hole; Min Operating Temperature: -30°C; Max Operating Temperature: 120°C; Packaging: Box; Application: Screwless; Number of Pins: 2; Number of Rows: 1; Orientation: 45°; Pitch: 7mm
JP4-JP8 = 6130XX11121_61300211121: MF: {'manufacturer': u'Wurth Electronics'}; Package: None; Price: None; Value: *; MP: 61300211121; Availability: Unavailable
R1-R6 R12 R13 = CMP-009-00018-5: Chip Resistor, 10 KOhm, +/- 1%, 125 mW, -55 to 155 degC, 0805 (2012 Metric); Power: 125mW; Voltage Rating: 150V; Tolerance: 1%; Pins: 2; Min Operating Temperature: -55°C; Case/Package: 0805; Max Operating Temperature: 155°C; RoHS Compliant: True; Mounting Technology: SM
R7 R8 = CMP-009-00029-5: Chip Resistor, 33 Ohm, +/- 1%, 0.063 W, -55 to 155 degC, 0402 (1005 Metric); Power: 63mW; Pins: 2; Mounting Technology: SM; Min Operating Temperature: -55°C; Tolerance: 1%; Max Operating Temperature: 155°C; RoHS Compliant: True; Case/Package: 0402
R10 = TC33X-2-103E: 10 kOhms 0.1W, 1/10W J Lead Surface Mount Trimmer Potentiometer Cermet 1 Turn Top Adjustment; MF: Bourns; MP: TC33X-2-103E; SnapEDA_Link: https://www.snapeda.com/parts/TC33X-2-103E/Bourns/view-part/47092/?ref=snap; Package: SOD-23 Bourns; Check_prices: https://www.snapeda.com/parts/TC33X-2-103E/Bourns/view-part/47092/?ref=eda; Value: *; Purchase-URL: https://pricing.snapeda.com/search/part/TC33X-2-103E/?ref=eda; Digi-Key_Part_Number: TC33X-103ECT-ND
U1 = BUCK_MODULE
U2 = TSZ152
U3 = CMP-0310-00278-1: Low-Voltage High-Speed Quadruple Differential Line Receiver, 3.3V, -40 to 85 degC, 16-Pin SOIC (D), Green (RoHS & no Sb/Br); Manufacturer: Texas Instruments; Supply Voltage(s)(V): 3.3; Receivers Per Package: 4; Rating: Catalog; SubFamily: RS-422; ESD(kV): 2; ICC(Max)(mA): 17; Mounting Technology: Surface Mount; Eco-Plan: Green (RoHS & no Sb/Br); Footprint: AM26LS32; PackageReference: D16; ComponentLink1Description: Datasheet; ComponentLink2URL: http://www.ti.com/litv/pdf/mpds178g; PartNumber: AM26LV32IDG4; ComponentLink2Description: Package Specification; ComponentLink1URL: http://www.ti.com/general/docs/lit/getliterature.tsp?genericPartNumber=AM26LV32&fileType=pdf; PackageDescription: 16-Pin Plastic Small Outline Integrated Circuit, 9.9 x 3.9 mm, Pitch 1.27 mm Pitch; Code_JEDEC: MS-012AC; DatasheetVersion: SLLS202E; PackageVersion: revM, Jun-2011
U4 = CAN